# Altium schematic sheet 7_MountingHoles.SchDoc: MountingHoles
size A4; ApprovedBy: Alcatraz; CheckedBy: Alcatraz; Author: Alcatraz; CompanyName: DHNLAB; DrawnBy: Alcatraz; Engineer: Alcatraz; Organization: DHNLAB PVT LTD; Address1: DHANBAD; Address2: JHARKHAND; Address3: INDIA; Address4: ASIA; DocumentNumber: 7; Revision: 1.0; SheetNumber: 7; SheetTotal: 7; ProjectTitle: USB-UART-ISO-CP2102
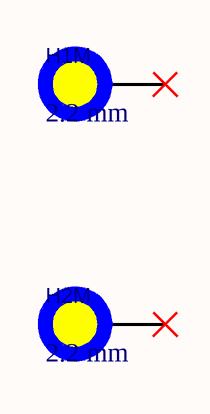
[diagram p0: 7_MountingHoles.SchDoc]

## Parts
H1M  2.2 mm  [MountingHole_2.2mm_M2_Pad_Via_Mask]  (no BOM)
H2M  2.2 mm  [MountingHole_2.2mm_M2_Pad_Via_Mask]  (no BOM)

## Nets

Not connected (* = marked no-connect by the designer): H1M 1*; H2M 1*

## Notes on the sheet
- Title:
- Author:
- Approved:
- Size:
- Date:
- Git Hash:
- A4
- Prj:
- SW Version:
- Variant:
- Edited:
- PUBLIC
- File:

## Library data of the parts
H1M H2M = MountingHole_Pad_2.2mm(M2): ki_description: Mounting Hole with connection; ki_fp_filters: MountingHole*Pad*; Supplier: ~; ki_keywords: mounting hole; Value: 2.2 mm